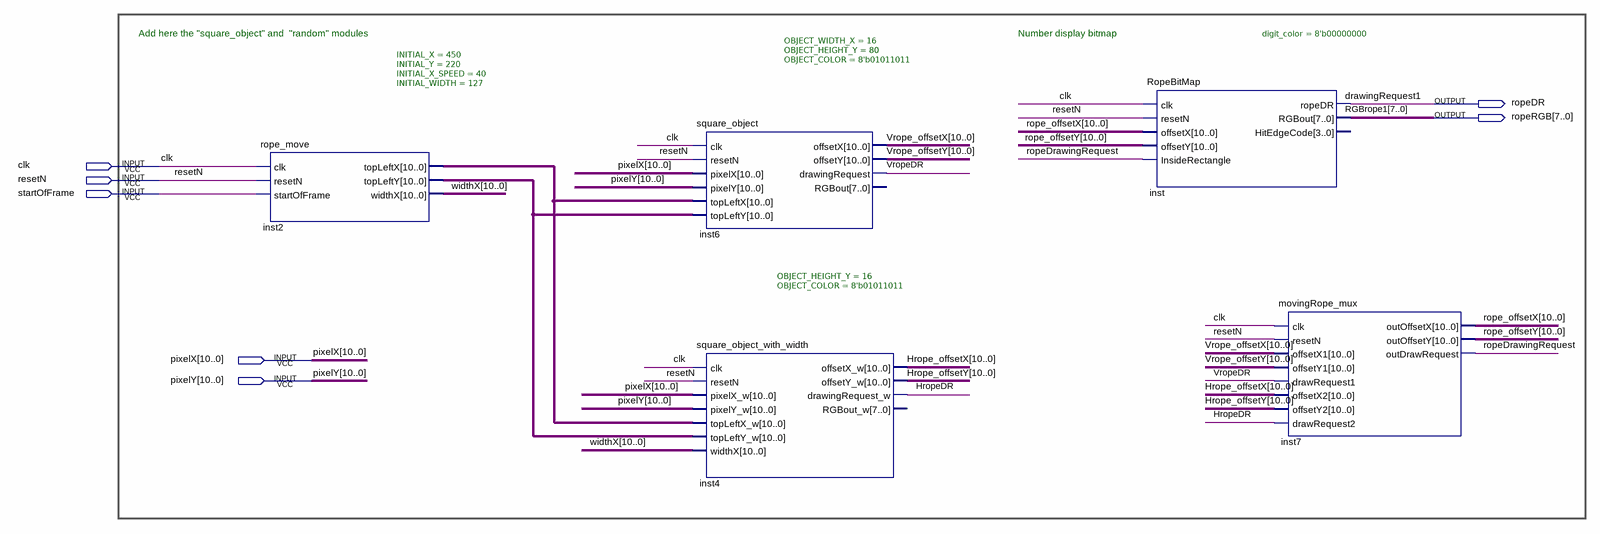
[diagram p0: schematic sheet]
// Quartus schematic MOVING_ROPE.bdf as structural Verilog: 5 symbols, 7 pins
module MOVING_ROPE (
  input  clk,
  input  resetN,
  input  startOfFrame,
  input  [10:0] pixelX,
  input  [10:0] pixelY,
  output ropeDR,
  output [7:0] ropeRGB
);

  wire HropeDR, ropeDrawingRequest, VropeDR;
  wire [10:0] Hrope_offsetX, Hrope_offsetY, inst2_topleftx, inst2_toplefty, rope_offsetX, rope_offsetY,
       Vrope_offsetX, Vrope_offsetY, widthX;

  rope_move #(.INITIAL_X(450), .INITIAL_Y(220), .INITIAL_X_SPEED(40), .INITIAL_WIDTH(127)) inst2 (
    .clk(clk), .resetN(resetN), .startOfFrame(startOfFrame), .topLeftX(inst2_topleftx),
    .topLeftY(inst2_toplefty), .widthX(widthX));
  square_object #(.OBJECT_WIDTH_X(16), .OBJECT_HEIGHT_Y(80), .OBJECT_COLOR(8'b01011011)) inst6 (
    .clk(clk), .resetN(resetN), .pixelX(pixelX), .pixelY(pixelY), .topLeftX(inst2_topleftx),
    .topLeftY(inst2_toplefty), .offsetX(Vrope_offsetX), .offsetY(Vrope_offsetY), .drawingRequest(VropeDR));  // open: RGBout
  square_object_with_width #(.OBJECT_HEIGHT_Y(16), .OBJECT_COLOR(8'b01011011)) inst4 (
    .clk(clk), .resetN(resetN), .pixelX_w(pixelX), .pixelY_w(pixelY), .topLeftX_w(inst2_topleftx),
    .topLeftY_w(inst2_toplefty), .widthX(widthX), .offsetX_w(Hrope_offsetX), .offsetY_w(Hrope_offsetY),
    .drawingRequest_w(HropeDR));  // open: RGBout_w
  RopeBitMap #(.digit_color(8'b00000000)) inst (
    .clk(clk), .resetN(resetN), .offsetX(rope_offsetX), .offsetY(rope_offsetY),
    .InsideRectangle(ropeDrawingRequest), .ropeDR(ropeDR), .RGBout(ropeRGB));  // open: HitEdgeCode
  movingRope_mux inst7 (
    .clk(clk), .resetN(resetN), .offsetX1(Vrope_offsetX), .offsetY1(Vrope_offsetY), .drawRequest1(VropeDR),
    .offsetX2(Hrope_offsetX), .offsetY2(Hrope_offsetY), .drawRequest2(HropeDR), .outOffsetX(rope_offsetX),
    .outOffsetY(rope_offsetY), .outDrawRequest(ropeDrawingRequest));

  // Other names for the same wires on the sheet: drawingRequest1 = ropeDR; RGBrope1[7:0] = ropeRGB

  // Notes on the sheet:
  //   Add here the "square_object" and  "random" modules
  //   Number display bitmap
endmodule
